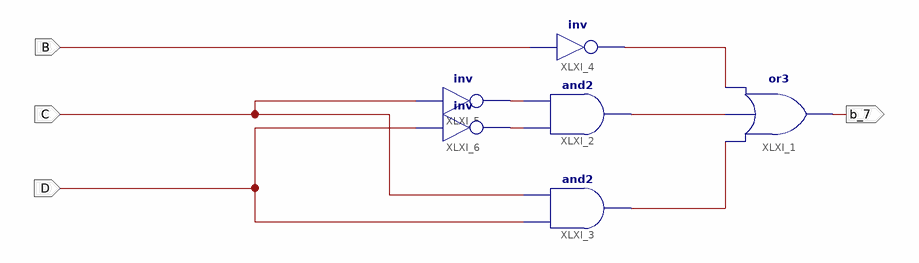
[diagram p0: schematic sheet 1]
// Xilinx ISE schematic bcd_for_b.sch (spartan6) as structural Verilog: 6 symbols, 4 ports
module bcd_for_b (
  input  B,
  input  C,
  input  D,
  output b_7
);

  wire XLXN_1, XLXN_2, XLXN_6, XLXN_10, XLXN_11;

  or XLXI_1 (b_7, XLXN_11, XLXN_10, XLXN_6);
  and XLXI_2 (XLXN_10, XLXN_2, XLXN_1);
  and XLXI_3 (XLXN_11, D, C);
  not XLXI_4 (XLXN_6, B);
  not XLXI_5 (XLXN_1, C);
  not XLXI_6 (XLXN_2, D);
endmodule
